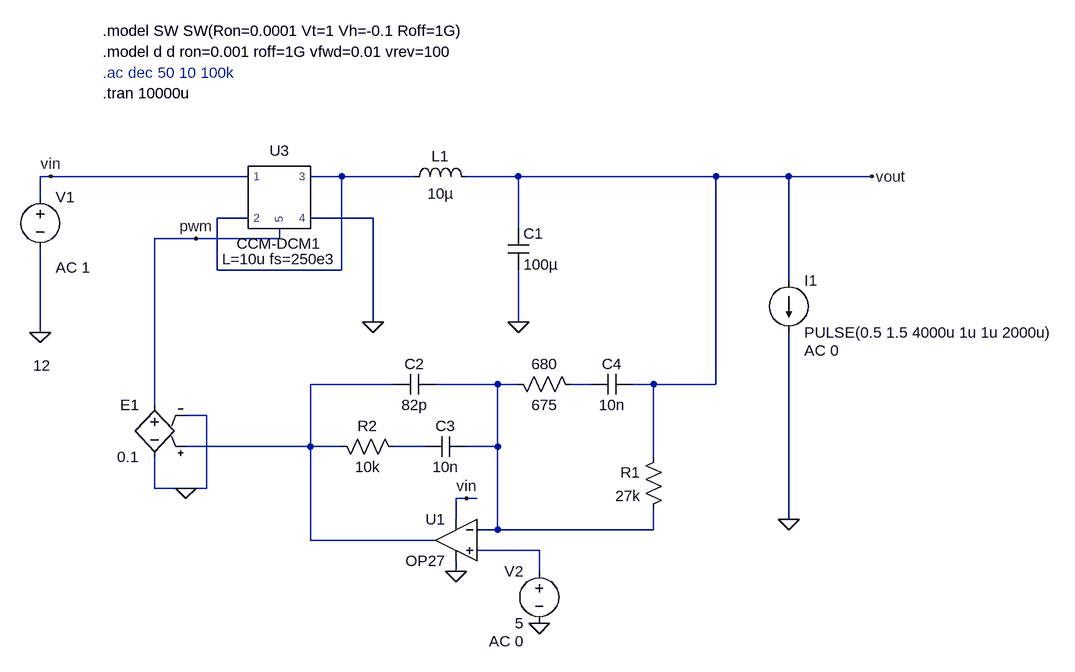
[diagram p0: schematic avg-ac-fb.asc]
avg-ac-fb.asc, the LTspice schematic file:
Version 4
SHEET 1 1492 844
WIRE -128 112 -144 112
WIRE 176 112 -128 112
WIRE 320 112 272 112
WIRE 432 112 320 112
WIRE 592 112 512 112
WIRE 896 112 592 112
WIRE 1008 112 896 112
WIRE 1136 112 1008 112
WIRE -144 144 -144 112
WIRE 176 176 128 176
WIRE 368 176 272 176
WIRE 592 192 592 112
WIRE 96 208 32 208
WIRE 224 208 224 192
WIRE 224 208 96 208
WIRE 128 256 128 176
WIRE 320 256 320 112
WIRE 320 256 128 256
WIRE 1008 272 1008 112
WIRE 368 336 368 176
WIRE 592 336 592 256
WIRE -144 352 -144 224
WIRE 400 432 272 432
WIRE 560 432 464 432
WIRE 592 432 560 432
WIRE 704 432 672 432
WIRE 800 432 768 432
WIRE 896 432 896 112
WIRE 896 432 800 432
WIRE 32 464 32 208
WIRE 112 480 80 480
WIRE 272 528 272 432
WIRE 272 528 80 528
WIRE 320 528 272 528
WIRE 448 528 400 528
WIRE 560 528 560 432
WIRE 560 528 512 528
WIRE 800 544 800 432
WIRE 32 592 32 544
WIRE 80 592 32 592
WIRE 112 592 112 480
WIRE 112 592 80 592
WIRE 512 608 496 608
WIRE 528 608 512 608
WIRE 496 640 496 608
WIRE 1008 640 1008 352
WIRE 560 656 560 528
WIRE 560 656 528 656
WIRE 800 656 800 624
WIRE 800 656 560 656
WIRE 272 672 272 528
WIRE 464 672 272 672
WIRE 624 688 528 688
WIRE 496 720 496 704
WIRE 624 720 624 688
FLAG -144 352 0
FLAG 1136 112 vout
FLAG -128 112 vin
FLAG 96 208 pwm
FLAG 80 592 0
FLAG 1008 640 0
FLAG 496 720 0
FLAG 512 608 vin
FLAG 624 800 0
FLAG 368 336 0
FLAG 592 336 0
SYMBOL voltage -144 128 R0
WINDOW 123 24 124 Left 2
WINDOW 39 0 0 Left 0
WINDOW 3 -11 275 Left 2
SYMATTR Value2 AC 1
SYMATTR Value 12
SYMATTR InstName V1
SYMBOL ind 416 128 R270
WINDOW 0 32 56 VTop 2
WINDOW 3 5 56 VBottom 2
SYMATTR InstName L1
SYMATTR Value 10µ
SYMATTR SpiceLine Rser=1e-2
SYMBOL cap 576 192 R0
SYMATTR InstName C1
SYMATTR Value 100µ
SYMATTR SpiceLine Rser=1e-2
SYMBOL e2 32 448 M0
SYMATTR InstName E1
SYMATTR Value 0.1
SYMBOL current 1008 272 R0
WINDOW 123 24 108 Left 2
WINDOW 39 0 0 Left 0
SYMATTR Value2 AC 0
SYMATTR InstName I1
SYMATTR Value PULSE(0.5 1.5 4000u 1u 1u 2000u)
SYMBOL CCM-DCM1 224 144 R0
SYMATTR InstName U3
SYMATTR SpiceLine L=10u fs=250e3
SYMBOL res 816 528 M0
SYMATTR InstName R1
SYMATTR Value 27k
SYMBOL res 304 512 M90
WINDOW 0 0 56 VBottom 2
WINDOW 3 32 56 VTop 2
SYMATTR InstName R2
SYMATTR Value 10k
SYMBOL res 576 416 M90
WINDOW 0 0 56 VBottom 2
WINDOW 3 32 56 VTop 2
SYMATTR InstName 680
SYMATTR Value 675
SYMBOL cap 400 416 M90
WINDOW 0 0 32 VBottom 2
WINDOW 3 32 32 VTop 2
SYMATTR InstName C2
SYMATTR Value 82p
SYMBOL cap 448 512 M90
WINDOW 0 0 32 VBottom 2
WINDOW 3 32 32 VTop 2
SYMATTR InstName C3
SYMATTR Value 10n
SYMBOL cap 704 416 M90
WINDOW 0 0 32 VBottom 2
WINDOW 3 32 32 VTop 2
SYMATTR InstName C4
SYMATTR Value 10n
SYMBOL voltage 624 704 M0
WINDOW 123 24 124 Left 2
WINDOW 39 0 0 Left 0
SYMATTR Value2 AC 0
SYMATTR InstName V2
SYMATTR Value 5
SYMBOL OpAmps\\OP27 496 608 M0
SYMATTR InstName U1
TEXT -48 -112 Left 2 !.model SW SW(Ron=0.0001 Vt=1 Vh=-0.1 Roff=1G)
TEXT -48 -80 Left 2 !.model d d ron=0.001 roff=1G vfwd=0.01 vrev=100
TEXT -48 -48 Left 2 ;.ac dec 50 10 100k
TEXT -48 -16 Left 2 !.tran 10000u

The netlist it stands for:
* avg-ac-fb.asc
V1 vin 0 12 AC 1
L1 N001 vout 10µ Rser=1e-2
C1 vout 0 100µ Rser=1e-2
E1 pwm 0 N002 0 0.1
I1 vout 0 PULSE(0.5 1.5 4000u 1u 1u 2000u) AC 0
XU3 vin N001 N001 0 pwm CCM-DCM1 L=10u fs=250e3  ; pins 1 2 3 4 5
R1 vout N003 27k
R2 N002 N005 10k
R§680 N003 N004 675
C2 N002 N003 82p
C3 N005 N003 10n
C4 N004 vout 10n
V2 N006 0 5 AC 0
XU1 N006 N003 vin 0 N002 OP27  ; pins In+ In- V+ V- OUT
.model SW SW(Ron=0.0001 Vt=1 Vh=-0.1 Roff=1G)
.model d d ron=0.001 roff=1G vfwd=0.01 vrev=100
* .ac dec 50 10 100k
.tran 10000u
.lib CCM-DCM1.mod
.lib ADI.lib
.backanno
.end